# Altium schematic sheet CAS Interface.SchDoc: RB25DET - CAS Interface
size A4; Address1: Drawn By:; Address2: Dan Visser; DocumentNumber: A; Revision: 0.1; SheetNumber: 7; SheetTotal: 12
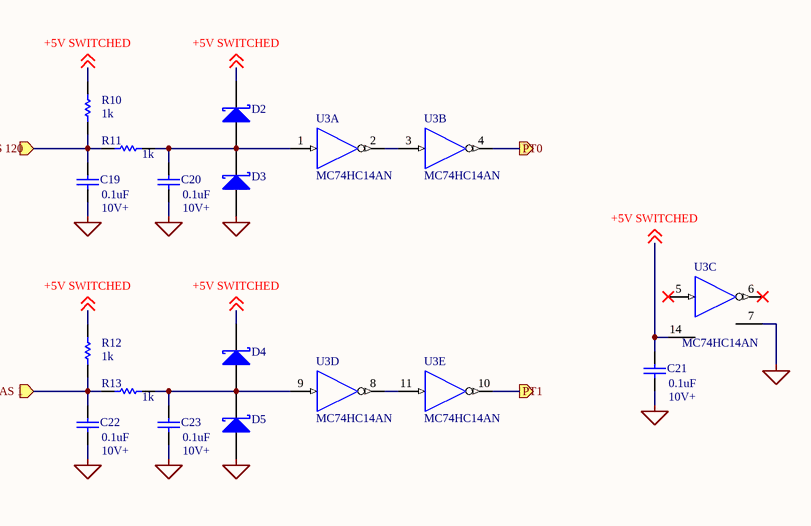
[diagram p0: CAS Interface.SchDoc]

## Parts
C19  value 0.1uF  [RAD-0.3]
C20  value 0.1uF  [RAD-0.3]
C21  value 0.1uF  [RAD-0.3]
C22  value 0.1uF  [RAD-0.3]
C23  value 0.1uF  [RAD-0.3]
D2  (no value)  [SMB]
D3  (no value)  [SMB]
D4  (no value)  [SMB]
D5  (no value)  [SMB]
R10  value 1k  [AXIAL-0.3]
R11  value 1k  [AXIAL-0.3]
R12  value 1k  [AXIAL-0.3]
R13  value 1k  [AXIAL-0.3]
U3  MC74HC14AN  [646-06]  (parts A,B,C,D,E of 6)

## Ports
CAS 1 (in), CAS 120 (in), PT0 (out), PT1 (out)

## Nets
GND: U3.7(GND)
NetC19_1: C19.1 C20.1 C21.1 C22.1 C23.1 D3.1(A) D5.1(A) U3.7(GND)
VDD: U3.14(VDD)
+5V SWITCHED: C21.2 D2.2(K) D4.2(K) R10.1 R12.1 U3.14(VDD) ; off-sheet +5V SWITCHED
CAS 1: C22.2 R12.2 R13.1 ; port CAS 1
CAS 120: C19.2 R10.2 R11.1 ; port CAS 120
PT0: U3.4(Y) ; port PT0
PT1: U3.10(Y) ; port PT1
NetC20_2: C20.2 D2.1(A) D3.2(K) R11.2 U3.1(A)
NetC23_2: C23.2 D4.1(A) D5.2(K) R13.2 U3.9(A)
NetU3_2: U3.2(Y) U3.3(A)
NetU3_8: U3.8(Y) U3.11(A)

Not connected (* = marked no-connect by the designer): U3 5(A)* 6(Y)*

## Notes on the sheet
- (near C19) 10V+
- 10V+
- (near C21) 10V+
- (near C22) 10V+
- Title
- Size:
- Date:
- A4
- Number:
- Time:
- Revision:
- Sheet
- of

## Library data of the parts
C19-C23 = Cap: Capacitor; Published: 8-Jun-2000; LatestRevisionDate: 17-Jul-2002; LatestRevisionNote: Re-released for DXP Platform.; PackageReference: RAD-0.3; Publisher: Altium Limited; PackageDescription: Radial Cap, Thru-Hole; 2 Leads; 0.3 in Pin Spacing
D2-D5 = D Schottky: Schottky Diode; Published: 8-Jun-2000; LatestRevisionDate: 17-Jul-2002; LatestRevisionNote: Re-released for DXP Platform.; PackageReference: SMB; Publisher: Altium Limited; PackageDescription: DO-214-AA/SMB; 2 C-Bend Leads; Body 5.3 x 3.6 mm, inc. leads (LxW); Code_JEDEC: DO-214-AA
R10-R13 = Res1: Resistor; Published: 8-Jun-2000; LatestRevisionDate: 17-Jul-2002; LatestRevisionNote: Re-released for DXP Platform.; PackageReference: AXIAL-0.3; Publisher: Altium Limited; PackageDescription: Axial Device, Thru-Hole; 2 Leads; 0.3 in Pin Spacing
U3 = MC74HC14AN: Hex Schmitt Trigger Inverter; Published: 17-Jul-2002; LatestRevisionDate: 06-Jun-2005; LatestRevisionNote: Stylized 3D Model Added; DatasheetVersion: 1989; PackageVersion: 1997; PackageReference: 646-06; Publisher: Altium Limited; PackageDescription: DIP; 14 Leads; Row Spacing 7.62 mm; Pitch 2.54 mm; ComponentLink1Description: Manufacturer Link; ComponentLink1URL: http://www.onsemi.com/site/products/parametrics/0,4446,247,00.html; ComponentLink2Description: Ibis Model; ComponentLink2URL: http://www.onsemi.com/pub/Collateral/MC54HC14AJ.IBS